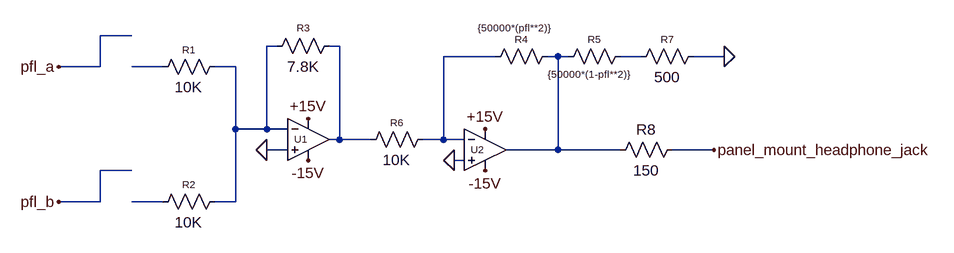
[diagram p0: schematic PFL_Output.asc]
PFL_Output.asc, the LTspice schematic file:
Version 4.1
SHEET 1 880 680
WIRE -416 48 -464 48
WIRE -192 64 -208 64
WIRE -96 64 -112 64
WIRE 144 80 64 80
WIRE 240 80 224 80
WIRE 256 80 240 80
WIRE 368 80 336 80
WIRE 496 80 448 80
WIRE -464 96 -464 48
WIRE -464 96 -528 96
WIRE -368 96 -416 96
WIRE -256 96 -288 96
WIRE -256 192 -256 96
WIRE -208 192 -208 64
WIRE -208 192 -256 192
WIRE -176 192 -208 192
WIRE -96 208 -96 64
WIRE -96 208 -112 208
WIRE -48 208 -96 208
WIRE 64 208 64 80
WIRE 64 208 32 208
WIRE 96 208 64 208
WIRE -176 224 -208 224
WIRE 240 224 240 80
WIRE 240 224 160 224
WIRE 336 224 240 224
WIRE 480 224 416 224
WIRE 96 240 80 240
WIRE -416 256 -464 256
WIRE -464 304 -464 256
WIRE -464 304 -528 304
WIRE -368 304 -416 304
WIRE -256 304 -256 192
WIRE -256 304 -288 304
FLAG -528 304 pfl_b
FLAG -528 96 pfl_a
FLAG -208 224 0
FLAG -144 240 -15V
FLAG -144 176 +15V
FLAG 128 192 +15V
FLAG 80 240 0
FLAG 496 80 0
FLAG 480 224 panel_mount_headphone_jack
FLAG 128 256 -15V
SYMBOL res -272 80 R90
WINDOW 0 0 56 VBottom 1
WINDOW 3 32 56 VTop 2
SYMATTR InstName R1
SYMATTR Value 10K
SYMATTR SpiceLine tol=1
SYMBOL res -272 288 R90
WINDOW 0 0 56 VBottom 1
WINDOW 3 32 56 VTop 2
SYMATTR InstName R2
SYMATTR Value 10K
SYMATTR SpiceLine tol=1
SYMBOL OpAmps\\UniversalOpAmp2 -144 208 R0
WINDOW 0 -22 -1 Left 1
SYMATTR InstName U1
SYMATTR Value2 Avol=200K GBW=10Meg Slew=9Meg
SYMATTR SpiceLine Ilimit=30m Rail=0 Vos=0
SYMBOL res -208 80 R270
WINDOW 0 34 56 VTop 1
WINDOW 3 0 56 VBottom 2
SYMATTR InstName R3
SYMATTR Value 7.8K
SYMATTR SpiceLine tol=1
SYMBOL res 128 96 R270
WINDOW 0 32 56 VTop 1
WINDOW 3 71 44 VBottom 1
SYMATTR InstName R4
SYMATTR Value {50000*(pfl**2)}
SYMATTR SpiceLine tol=1
SYMBOL res 240 96 R270
WINDOW 0 32 56 VTop 1
WINDOW 3 -1 47 VBottom 1
SYMATTR InstName R5
SYMATTR Value {50000*(1-pfl**2)}
SYMATTR SpiceLine tol=1
SYMBOL res 48 192 R90
WINDOW 0 0 56 VBottom 1
WINDOW 3 32 56 VTop 2
SYMATTR InstName R6
SYMATTR Value 10K
SYMATTR SpiceLine tol=1
SYMBOL res 464 64 R90
WINDOW 0 0 56 VBottom 1
WINDOW 3 32 56 VTop 2
SYMATTR InstName R7
SYMATTR Value 500
SYMATTR SpiceLine tol=1
SYMBOL OpAmps\\UniversalOpAmp2 128 224 R0
WINDOW 0 -22 -1 Left 1
SYMATTR InstName U2
SYMATTR Value2 Avol=200K GBW=10Meg Slew=9Meg
SYMATTR SpiceLine Ilimit=30m Rail=0 Vos=0
SYMBOL res 432 208 R90
WINDOW 0 0 56 VBottom 2
WINDOW 3 32 56 VTop 2
SYMATTR InstName R8
SYMATTR Value 150

The netlist it stands for:
* PFL_Output.asc
R1 N001 N006 10K tol=1
R2 N001 N007 10K tol=1
X§U1 0 N001 +15V -15V N002 level2 Avol=200K GBW=10Meg Slew=9Meg Ilimit=30m Rail=0 Vos=0 En=0 Enk=0 In=0 Ink=0 Rin=500Meg  ; pins In+ In- V+ V- OUT
R3 N001 N002 7.8K tol=1
R4 N003 N004 {50000*(pfl**2)} tol=1
R5 N004 N005 {50000*(1-pfl**2)} tol=1
R6 N003 N002 10K tol=1
R7 0 N005 500 tol=1
X§U2 0 N003 +15V -15V N004 level2 Avol=200K GBW=10Meg Slew=9Meg Ilimit=30m Rail=0 Vos=0 En=0 Enk=0 In=0 Ink=0 Rin=500Meg  ; pins In+ In- V+ V- OUT
R8 panel_mount_headphone_jack N004 150
.lib UniversalOpAmp2.lib
.backanno
.end